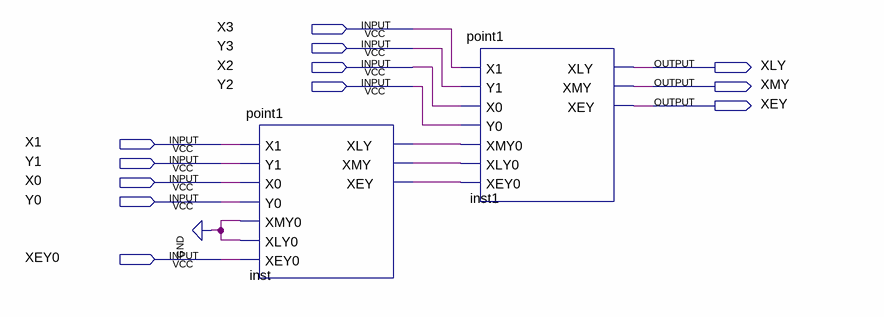
[diagram p0: schematic sheet]
// Quartus schematic point2.bdf as structural Verilog: 2 symbols, 12 pins
module point2 (
  input  X3,
  input  Y3,
  input  X2,
  input  Y2,
  input  X1,
  input  Y1,
  input  X0,
  input  Y0,
  input  XEY0,
  output XLY,
  output XMY,
  output XEY
);

  wire inst_xey, inst_xly, inst_xmy;

  point1 inst (
    .X1(X1), .Y1(Y1), .X0(X0), .Y0(Y0), .XMY0(1'b0), .XLY0(1'b0), .XEY0(XEY0), .XLY(inst_xly),
    .XMY(inst_xmy), .XEY(inst_xey));
  point1 inst1 (
    .X1(X3), .Y1(Y3), .X0(X2), .Y0(Y2), .XMY0(inst_xly), .XLY0(inst_xmy), .XEY0(inst_xey), .XLY(XLY),
    .XMY(XMY), .XEY(XEY));
endmodule
